# EAGLE design gps_and_sensor_20180111 (EAGLE 8.5.2)
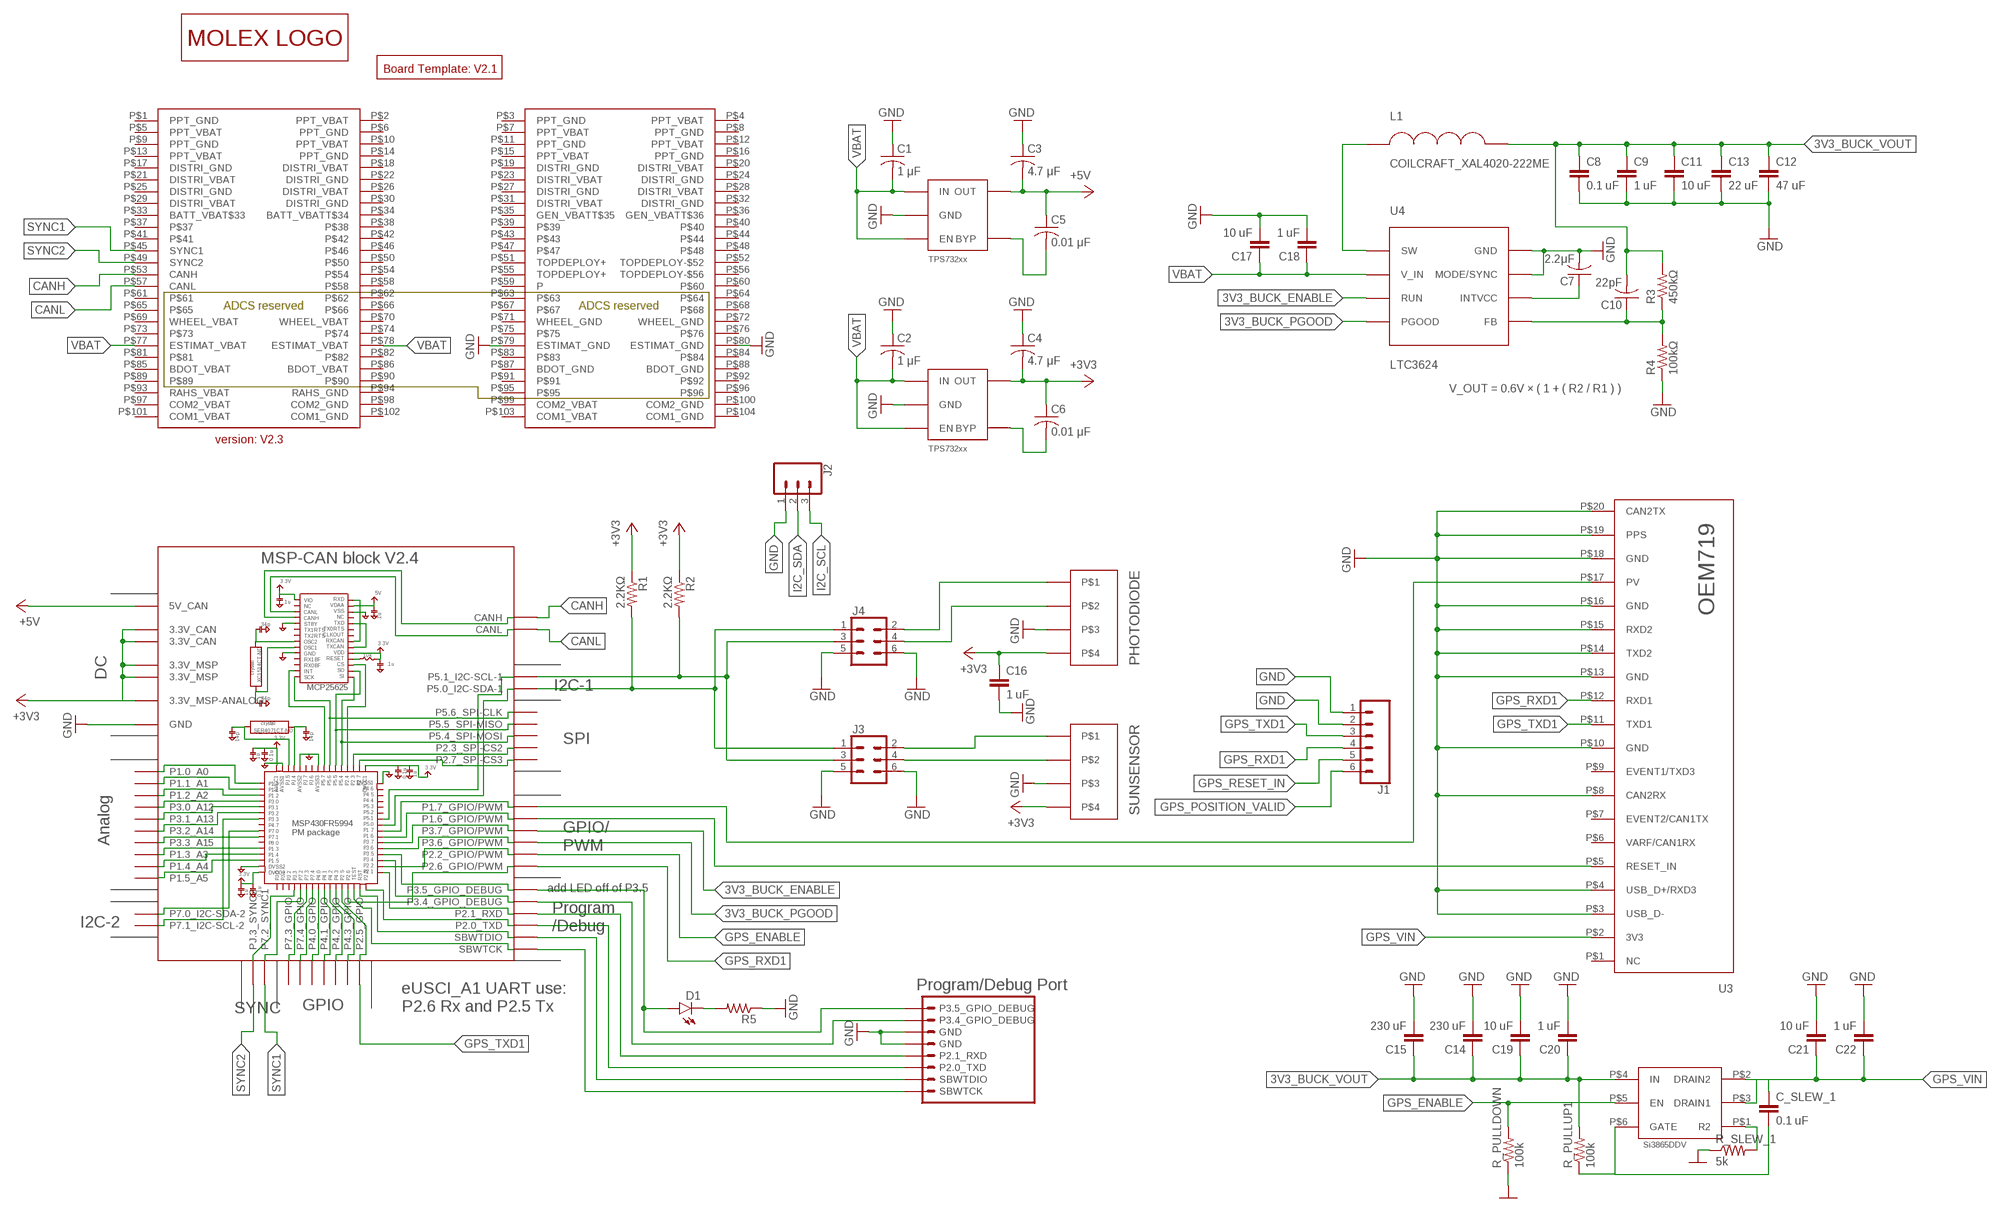
[diagram p0: schematic, sheet 1]

## Parts
B1  BOARD_TEMPLATE1  [BOARD_TEMPLATE]
BLK1  MSP-CAN_BLOCK  [MSP-CAN_BLOCK]
C1  1 μF  C-USC0805  [C0805]
C2  1 μF  C-USC0805  [C0805]
C3  4.7 μF  C-USC0805  [C0805]
C4  4.7 μF  C-USC0805  [C0805]
C5  0.01 μF  C-USC0805  [C0805]
C6  0.01 μF  C-USC0805  [C0805]
C7  2.2μF  C-USC0805  [C0805]
C8  0.1 uF  CAPACITOR0805  [0805]
C9  1 uF  CAPACITOR0805  [0805]
C10  22pF  C-USC0805  [C0805]
C11  10 uF  CAPACITOR0805  [0805]
C12  47 uF  CAPACITOR1206  [1206]
C13  22 uF  CAPACITOR1206  [1206]
C14  230 uF  CAPACITORPANASONIC_16SVPG270M  [PANASONIC_SVPG]
C15  230 uF  CAPACITORPANASONIC_16SVPG270M  [PANASONIC_SVPG]
C16  1 uF  CAPACITOR0805  [0805]
C17  10 uF  CAPACITOR0805  [0805]
C18  1 uF  CAPACITOR0805  [0805]
C19  10 uF  CAPACITOR0805  [0805]
C20  1 uF  CAPACITOR0805  [0805]
C21  10 uF  CAPACITOR0805  [0805]
C22  1 uF  CAPACITOR0805  [0805]
C_SLEW_1  0.1 uF  CAPACITOR0805  [0805]
CONN1  PC104_CONNECTOR  [PC104_CONNECTOR]
D1  LED  [LED-1206]
J1  CONN_06LOCK  [1X06_LOCK]
J2  CONN_03LOCK  [1X03_LOCK]
J3  CONN_03X22X3_SILK_MALE_PTH  [2X3]
J4  CONN_03X22X3_SILK_MALE_PTH  [2X3]
L1  COILCRAFT_XAL4020-222ME  [COILCRAFT_XAL4020]
PHOTODIODE  PICOLOCK_4  [PICOLOCK_4]
R1  2.2KΩ  R-US_R0805  [R0805]
R2  2.2KΩ  R-US_R0805  [R0805]
R3  450kΩ  R-US_R0805  [R0805]
R4  100kΩ  R-US_R0805  [R0805]
R5  RESISTOR0805  [0805]
R_PULLDOWN  100k  RESISTOR0805  [0805]
R_PULLUP1  100k  RESISTOR0805  [0805]
R_SLEW_1  5k  RESISTOR0805  [0805]
SUNSENSOR  PICOLOCK_4  [PICOLOCK_4]
U1  TPS732XX  [SOT-23-5]
U2  TPS732XX  [SOT-23-5]
U3  OEM719  [OEM719]
U4  LTC3624  [LTC3624]
U$1  LOGO_MOLEX  [LOGO_MOLEX]
U$2  PROGRAM/DEBUG_PORT  [1X08_CONNECTOR]
U$3  SI3865DDV  [TSOP-6]

## Nets
3V3_BUCK_ENABLE: BLK1.P3.7_GPIO/PWM U4.RUN
3V3_BUCK_FB: C10.1 R3.1 R4.2 U4.FB
3V3_BUCK_INTVCC: C7.1 U4.INTVCC
3V3_BUCK_PGOOD: BLK1.P3.6_GPIO/PWM U4.PGOOD
3V3_BUCK_SW: L1.P$1 U4.SW
3V3_BUCK_VOUT: C8.1 C9.1 C10.2 C11.1 C12.1 C13.1 C14.POS C15.POS C19.1 C20.1 L1.P$2 R3.2 R_PULLUP1.2 U$3.P$4(IN)
CANH: BLK1.CANH CONN1.P$53(CANH)
CANL: BLK1.CANL CONN1.P$57(CANL)
GND: BLK1.GND@1(GND) BLK1.GND@2(GND) BLK1.GND@3(GND) BLK1.GND@4(GND) BLK1.GND@5(GND) BLK1.GND@7(GND) BLK1.GND@8(GND) BLK1.GND@9(GND) BLK1.GND@10(GND) BLK1.GND@11(GND) BLK1.GND@12(GND) BLK1.GND@13(GND) BLK1.GND@14(GND) BLK1.GND@15(GND) BLK1.GND@16(GND) BLK1.GND@17(GND) BLK1.GND@26(GND) C1.1 C2.1 C3.1 C4.1 C7.2 C8.2 C9.2 C11.2 C12.2 C13.2 C14.NEG C15.NEG C16.2 C17.2 C18.2 C19.2 C20.2 C21.2 C22.2 CONN1.P$79(ESTIMAT_GND) CONN1.P$80(ESTIMAT_GND) J1.1 J1.2 J2.1 J3.5 J3.6 J4.5 J4.6 PHOTODIODE.P$3 R4.1 R5.1 R_PULLDOWN.1 R_SLEW_1.1 SUNSENSOR.P$3 U1.P$2(GND) U2.P$2(GND) U3.P$3(USB_D-) U3.P$4(USB_D+/RXD3) U3.P$8(CAN2RX) U3.P$10(GND) U3.P$13(GND) U3.P$14(TXD2) U3.P$15(RXD2) U3.P$16(GND) U3.P$18(GND) U3.P$19(PPS) U3.P$20(CAN2TX) U4.GND@1(GND) U4.GND@PAD(GND) U4.MODE/SYNC U$2.5(GND) U$2.6(GND) ; supply symbol labelled DGND
GPS_ENABLE: BLK1.P2.2_GPIO/PWM R_PULLDOWN.2 U$3.P$5(EN)
GPS_POSITION_VALID: BLK1.P1.7_GPIO/PWM J1.6 U3.P$17(PV)
GPS_RESET_IN: BLK1.P1.6_GPIO/PWM J1.5 U3.P$5(RESET_IN)
GPS_RXD1: BLK1.P2.6_GPIO/PWM J1.4 U3.P$12(RXD1)
GPS_TXD1: BLK1.P2.5_GPIO J1.3 U3.P$11(TXD1)
GPS_VIN: C21.1 C22.1 C_SLEW_1.1 U3.P$2(3V3) U$3.P$2(DRAIN2) U$3.P$3(DRAIN1)
I2C_SCL: BLK1.P5.1_I2C-SCL-1 J2.3 J3.3 J4.3 R2.2
I2C_SDA: BLK1.P5.0_I2C-SDA-1 J2.2 J3.1 J4.1 R1.2
LDO_3V3: BLK1.3.3V@CAN1(3.3V_CAN) BLK1.3.3V@CAN2(3.3V_CAN) BLK1.3.3V@MSP1(3.3V_MSP) BLK1.3.3V@MSP2(3.3V_MSP) BLK1.3.3V_ANALOG@MSP2(3.3V_MSP-ANALOG) C4.2 C6.1 C16.1 PHOTODIODE.P$4 R1.1 R2.1 SUNSENSOR.P$4 U2.P$5(OUT) ; supply symbol labelled +3V3
LDO_3V3_BYP: C6.2 U2.P$4(BYP)
LDO_5V: BLK1.5V(5V_CAN) C3.2 C5.1 U1.P$5(OUT) ; supply symbol labelled +5V
LDO_5V_BYP: C5.2 U1.P$4(BYP)
N$1: BLK1.P3.5_GPIO_DEBUG D1.A U$2.8(P3.5_GPIO_DEBUG)
N$2: R_SLEW_1.2 U$3.P$1(R2)
N$3: BLK1.P3.4_GPIO_DEBUG U$2.7(P3.4_GPIO_DEBUG)
N$4: C_SLEW_1.2 R_PULLUP1.1 U$3.P$6(GATE)
N$5: BLK1.P2.1_RXD U$2.4(P2.1_RXD)
N$6: BLK1.P2.0_TXD U$2.3(P2.0_TXD)
N$7: BLK1.SBWTDIO U$2.2(SBWTDIO)
N$8: BLK1.SBWTCK U$2.SBWTCK
N$9: D1.C R5.2
PHOTODIODE_SCL: J4.4 PHOTODIODE.P$2
PHOTODIODE_SDA: J4.2 PHOTODIODE.P$1
SUNSENSOR_SCL: J3.4 SUNSENSOR.P$2
SUNSENSOR_SDA: J3.2 SUNSENSOR.P$1
SYNC1: BLK1.P7.2_SYNC1 CONN1.P$45(SYNC1)
SYNC2: BLK1.PJ.3_SYNC2 CONN1.P$49(SYNC2)
VBAT: C1.2 C2.2 C17.1 C18.1 CONN1.P$77(ESTIMAT_VBAT) CONN1.P$78(ESTIMAT_VBAT) U1.P$1(IN) U1.P$3(EN) U2.P$1(IN) U2.P$3(EN) U4.V_IN
Unconnected: BLK1.P1.0_A0 BLK1.P1.1_A1 BLK1.P1.2_A2 BLK1.P1.3_A3 BLK1.P1.4_A4 BLK1.P1.5_A5 BLK1.P2.4_SPI-CS2(P2.3_SPI-CS2) BLK1.P2.7_SPI-CS3 BLK1.P3.0_A12 BLK1.P3.1_A13 BLK1.P3.2_A14 BLK1.P3.3_A15 BLK1.P4.0_GPIO BLK1.P4.1_GPIO BLK1.P4.2_GPIO BLK1.P4.3_GPIO BLK1.P5.4_SPI-MOSI BLK1.P5.5_SPI-MISO BLK1.P5.6_SPI-CLK BLK1.P7.0_I2C-SDA-2 BLK1.P7.1_I2C-SCL-2 BLK1.P7.3_GPIO BLK1.P7.4_GPIO CONN1.P$1(PPT_GND) CONN1.P$2(PPT_VBAT) CONN1.P$3(PPT_GND) CONN1.P$4(PPT_VBAT) CONN1.P$5(PPT_VBAT) CONN1.P$6(PPT_GND) CONN1.P$7(PPT_VBAT) CONN1.P$8(PPT_GND) CONN1.P$9(PPT_GND) CONN1.P$10(PPT_VBAT) CONN1.P$11(PPT_GND) CONN1.P$12(PPT_VBAT) CONN1.P$13(PPT_VBAT) CONN1.P$14(PPT_GND) CONN1.P$15(PPT_VBAT) CONN1.P$16(PPT_GND) CONN1.P$17(DISTRI_GND) CONN1.P$18(DISTRI_VBAT) CONN1.P$19(DISTRI_GND) CONN1.P$20(DISTRI_VBAT) CONN1.P$21(DISTRI_VBAT) CONN1.P$22(DISTRI_GND) CONN1.P$23(DISTRI_VBAT) CONN1.P$24(DISTRI_GND) CONN1.P$25(DISTRI_GND) CONN1.P$26(DISTRI_VBAT) CONN1.P$27(DISTRI_GND) CONN1.P$28(DISTRI_VBAT) CONN1.P$29(DISTRI_VBAT) CONN1.P$30(DISTRI_GND) CONN1.P$31(DISTRI_VBAT) CONN1.P$32(DISTRI_GND) CONN1.P$33(BATT_VBAT$33) CONN1.P$34(BATT_VBATT$34) CONN1.P$35(GEN_VBATT$35) CONN1.P$36(GEN_VBATT$36) CONN1.P$37 CONN1.P$38 CONN1.P$39 CONN1.P$40 CONN1.P$41 CONN1.P$42 CONN1.P$43 CONN1.P$44 CONN1.P$46 CONN1.P$47 CONN1.P$48 CONN1.P$50 CONN1.P$51(TOPDEPLOY+) CONN1.P$52(TOPDEPLOY-$52) CONN1.P$54 CONN1.P$55(TOPDEPLOY+) CONN1.P$56(TOPDEPLOY-$56) CONN1.P$58 CONN1.P$59(P) CONN1.P$60 CONN1.P$61 CONN1.P$62 CONN1.P$63 CONN1.P$64 CONN1.P$65 CONN1.P$66 CONN1.P$67 CONN1.P$68 CONN1.P$69(WHEEL_VBAT) CONN1.P$70(WHEEL_VBAT) CONN1.P$71(WHEEL_GND) CONN1.P$72(WHEEL_GND) CONN1.P$73 CONN1.P$74 CONN1.P$75 CONN1.P$76 CONN1.P$81 CONN1.P$82 CONN1.P$83 CONN1.P$84 CONN1.P$85(BDOT_VBAT) CONN1.P$86(BDOT_VBAT) CONN1.P$87(BDOT_GND) CONN1.P$88(BDOT_GND) CONN1.P$89 CONN1.P$90 CONN1.P$91 CONN1.P$92 CONN1.P$93(RAHS_VBAT) CONN1.P$94(RAHS_GND) CONN1.P$95 CONN1.P$96 CONN1.P$97(COM2_VBAT) CONN1.P$98(COM2_GND) CONN1.P$99(COM2_VBAT) CONN1.P$100(COM2_GND) CONN1.P$101(COM1_VBAT) CONN1.P$102(COM1_GND) CONN1.P$103(COM1_VBAT) CONN1.P$104(COM1_GND) U3.P$1(NC) U3.P$6(VARF/CAN1RX) U3.P$7(EVENT2/CAN1TX) U3.P$9(EVENT1/TXD3)

## Notes on the sheet
- V_OUT = 0.6V × ( 1 + ( R2 / R1 ) )

## Library data of the parts
B1 = DubSat1 Components:BOARD_TEMPLATE
BLK1 = DubSat1 Components:MSP-CAN_BLOCK
C1-C7 C10 = rcl:C-US: CAPACITOR, American symbol
C8 C9 C11-C22 C_SLEW_1 = DubSat1 Components:CAPACITOR: Capacitor Standard 0603 ceramic capacitor, and 0.1" leaded capacitor.
CONN1 = DubSat1 Components:PC104_CONNECTOR
D1 = DubSat1 Components:LED
J1 = SparkFun-Connectors:CONN_06: Multi connection point. Often used as Generic Header-pin footprint for 0.1 inch spaced/style header connections On any of the 0.1 inch spaced packages, you can populate with these: Break Away Headers - Straight <https://www.sparkfun.com/products/116> (PRT-00116) Break Away Male Headers - Right Angle <https://www.sparkfun.com/products/553> (PRT-00553) Female Headers <https://www.sparkfun.com/products/115> (PRT-00115) Break Away Headers - Machine Pin <https://www.sparkfun.com/products/117> (PRT-00117) Break Away Female Headers - Swiss Machine Pin <https://www.sparkfun.com/products/743> (PRT-00743) Arduino Stackable Header - 6 Pin <https://www.sparkfun.com/products/9280> (PRT-09280) For SCREWTERMINALS and SPRING TERMINALS visit here: Screw Terimnals on SparkFun.com <https://www.sparkfun.com/search/results?term=Screw+Terminals> (5mm/3.5mm/2.54mm spacing) This device is also useful as a general connection point to wire up your design to another part of your project. Our various solder wires solder well into these plated through hole pads. Hook-Up Wire - Assortment (Stranded, 22 AWG) <https://www.sparkfun.com/products/11375> (PRT-11375) Hook-Up Wire - Assortment (Solid Core, 22 AWG) <https://www.sparkfun.com/products/11367> (PRT-11367) View the entire wire category on our website here <https://www.sparkfun.com/categories/141>
J2 = SparkFun-Connectors:CONN_03: Multi connection point. Often used as Generic Header-pin footprint for 0.1 inch spaced/style header connections On any of the 0.1 inch spaced packages, you can populate with these: Break Away Headers - Straight <https://www.sparkfun.com/products/116> (PRT-00116) Break Away Male Headers - Right Angle <https://www.sparkfun.com/products/553> (PRT-00553) Female Headers <https://www.sparkfun.com/products/115> (PRT-00115) Break Away Headers - Machine Pin <https://www.sparkfun.com/products/117> (PRT-00117) Break Away Female Headers - Swiss Machine Pin <https://www.sparkfun.com/products/743> (PRT-00743) Stackable Header - 3 Pin (Female, 0.1") <https://www.sparkfun.com/products/13875> (PRT-13875) For SCREWTERMINALS and SPRING TERMINALS visit here: Screw Terimnals on SparkFun.com <https://www.sparkfun.com/search/results?term=Screw+Terminals> (5mm/3.5mm/2.54mm spacing) This device is also useful as a general connection point to wire up your design to another part of your project. Our various solder wires solder well into these plated through hole pads. Hook-Up Wire - Assortment (Stranded, 22 AWG) <https://www.sparkfun.com/products/11375> (PRT-11375) Hook-Up Wire - Assortment (Solid Core, 22 AWG) <https://www.sparkfun.com/products/11367> (PRT-11367) View the entire wire category on our website here <https://www.sparkfun.com/categories/141> Special notes: Molex polarized connector foot print use with SKU : PRT-08232 with associated crimp pins and housings.
J3 J4 = SparkFun-Connectors:CONN_03X2: Multi connection point. Often used as Generic Header-pin footprint for 0.1 inch spaced/style header connections You can populate with any combo of single row headers, but if you'd like an exact match, check these: Header - 2x3 (Male, 0.1") <https://www.sparkfun.com/products/12807> (PRT-12807) Header - 2x3 (Female, 0.1") <https://www.sparkfun.com/products/13010> (PRT-13010) 2x3 Pin Shrouded Header <https://www.sparkfun.com/products/10877> (PRT-10877) On any of the 0.1 inch spaced packages, you can populate with these: Break Away Headers - Straight <https://www.sparkfun.com/products/116> (PRT-00116) Break Away Male Headers - Right Angle <https://www.sparkfun.com/products/553> (PRT-00553) Female Headers <https://www.sparkfun.com/products/115> (PRT-00115) Break Away Headers - Machine Pin <https://www.sparkfun.com/products/117> (PRT-00117) Break Away Female Headers - Swiss Machine Pin <https://www.sparkfun.com/products/743> (PRT-00743) Special note: the shrouded connector mates well with our 3x2 ribbon cables: Ribbon Crimp Connector - 6-pin (2x3, Female) <https://www.sparkfun.com/products/10651> (PRT-10651) Ribbon Cable - 6 wire (15ft) <https://www.sparkfun.com/products/10646> (PRT-10646); PROD_ID: CONN-09701
L1 = DubSat1 Components:COILCRAFT_XAL4020-222ME
PHOTODIODE SUNSENSOR = DubSat1 Components:PICOLOCK_4
R1-R4 = rcl:R-US_: RESISTOR, American symbol
R5 R_PULLDOWN R_PULLUP1 R_SLEW_1 = DubSat1 Components:RESISTOR: Resistor Basic schematic elements and footprints for 0603, 1206, and PTH resistors.
U1 U2 = DubSat1 Components:TPS732XX
U3 = DubSat1 Components:OEM719
U4 = DubSat1 Components:LTC3624
U$1 = HuskySat-1 Logos:LOGO_MOLEX
U$2 = DubSat1 Components:PROGRAM/DEBUG_PORT
U$3 = DubSat1 Components:SI3865DDV

## Board
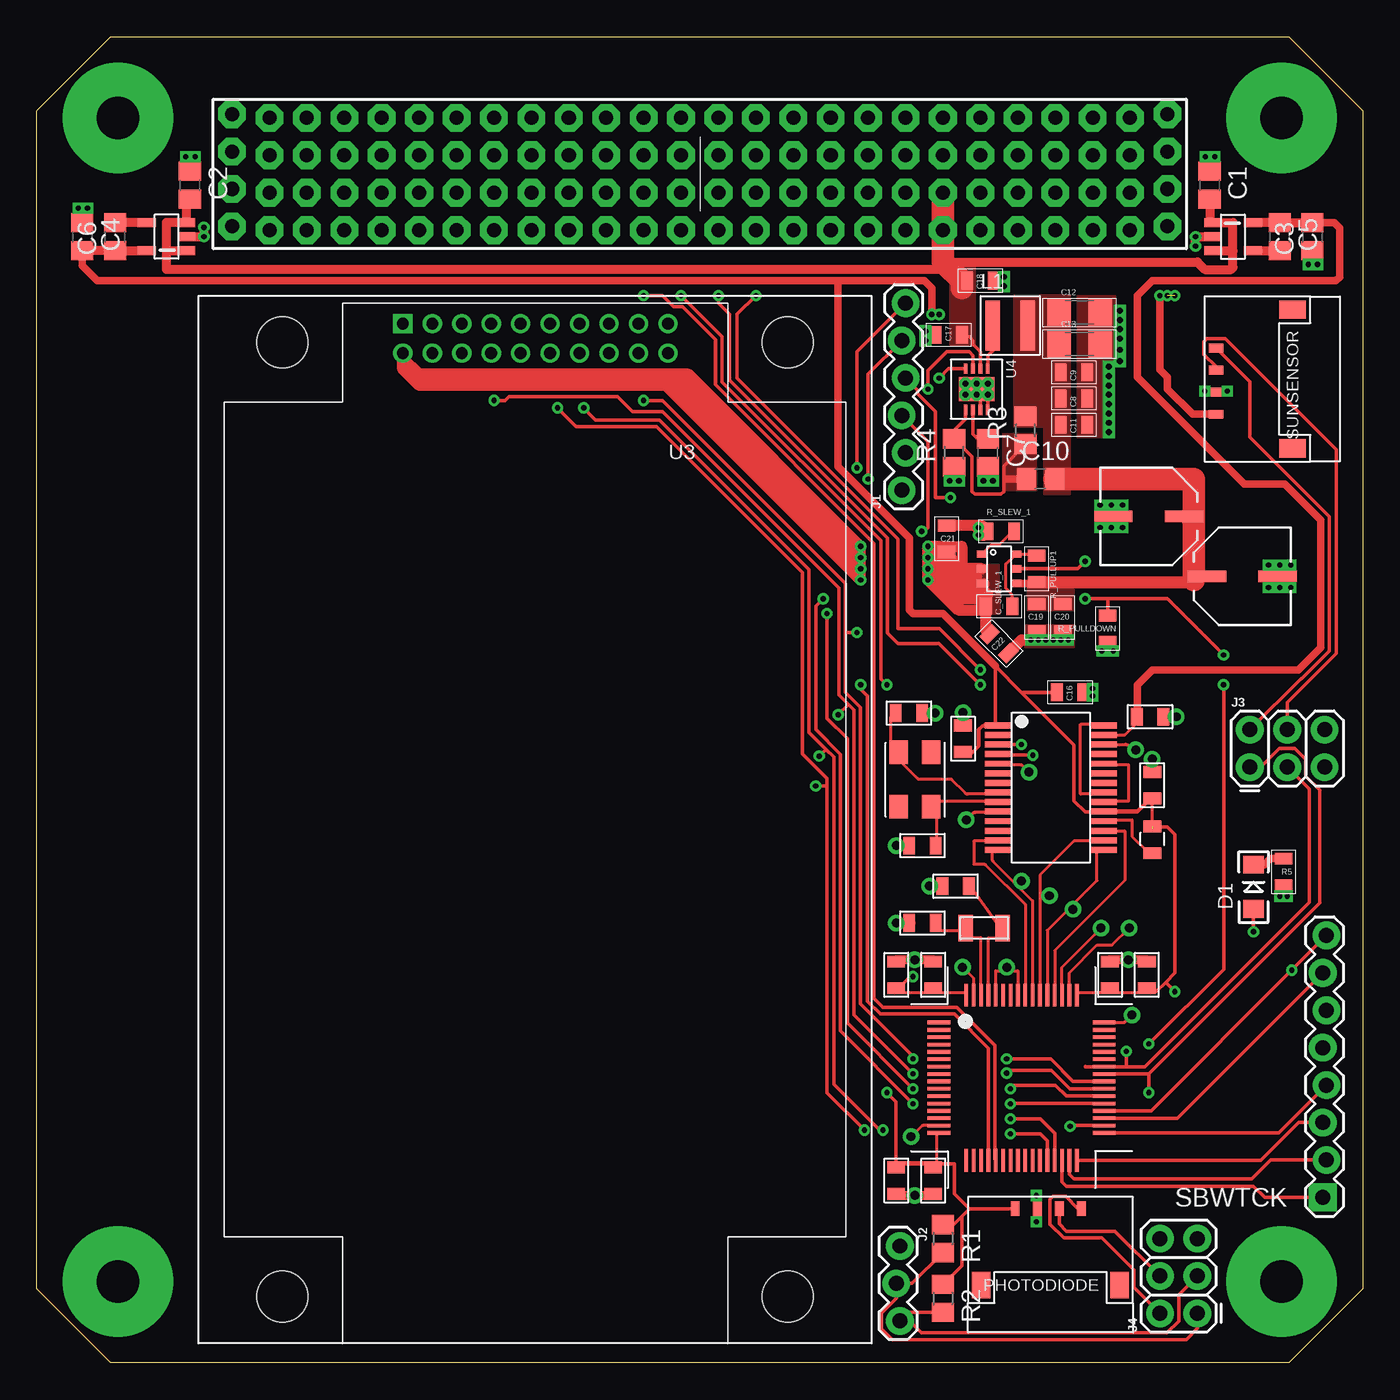
[diagram p1: board, top side]
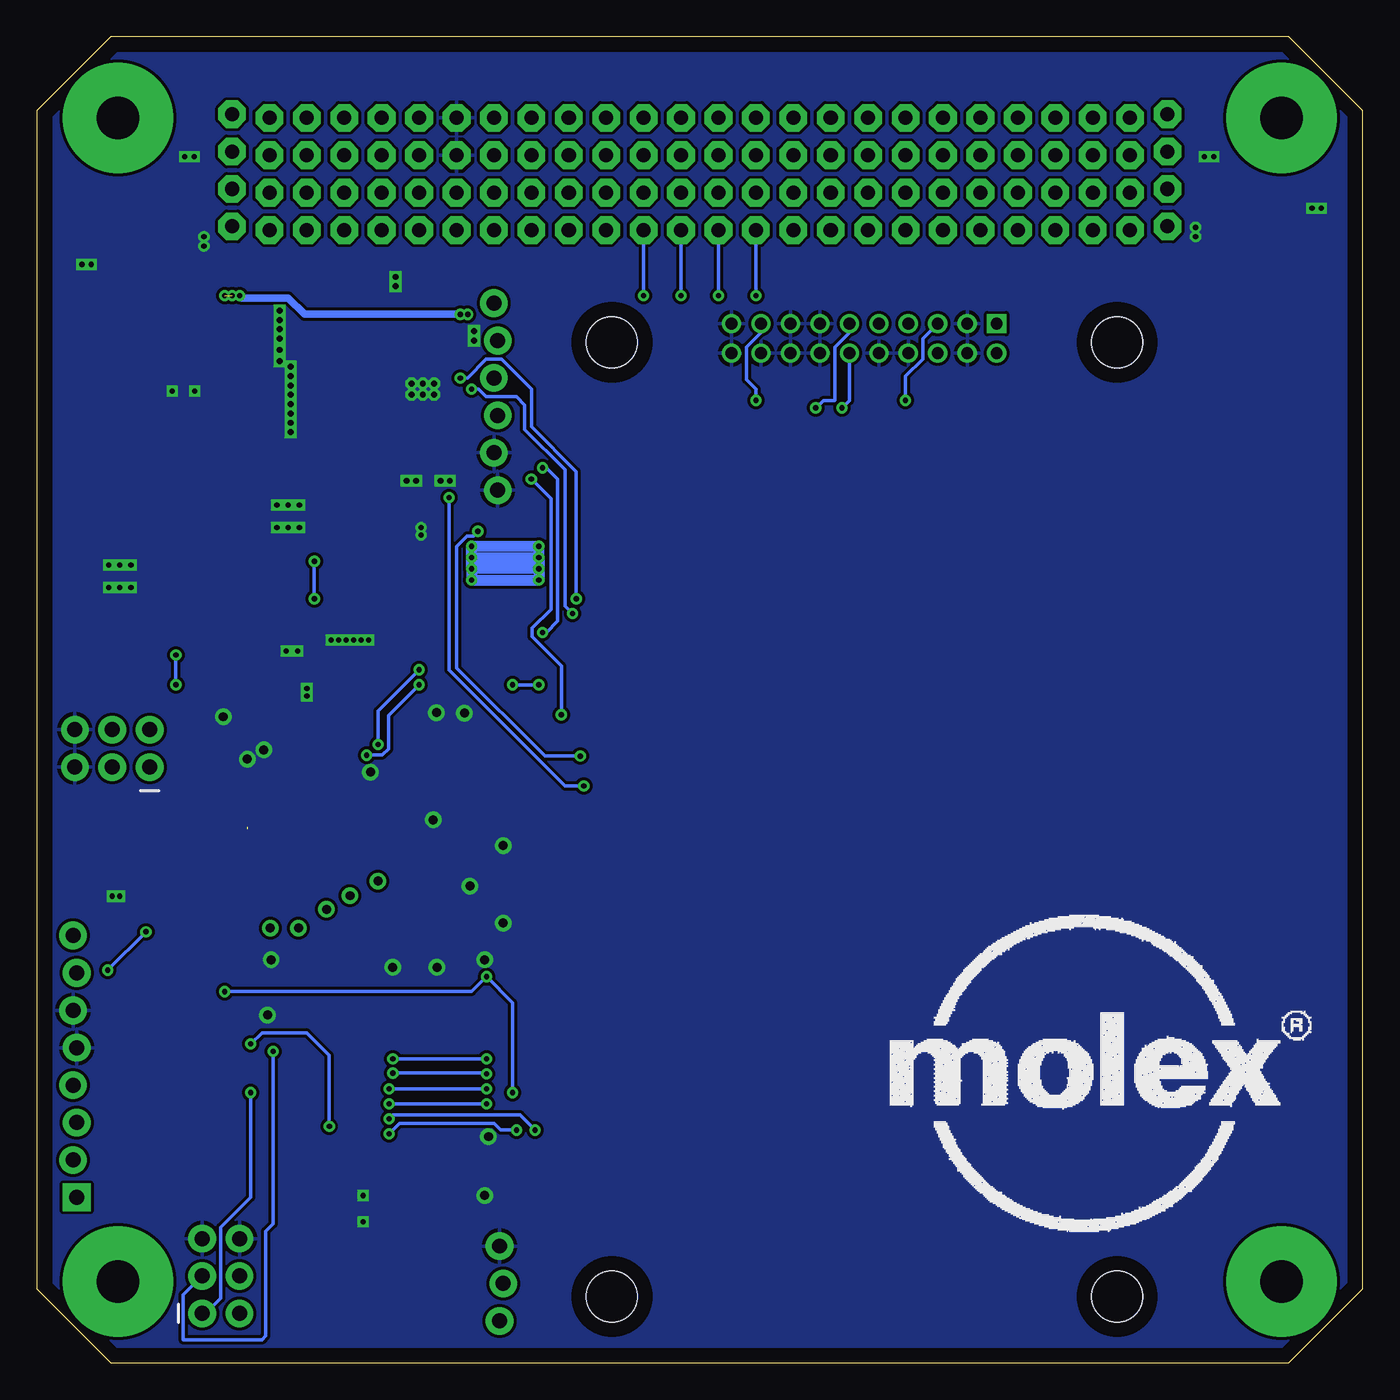
[diagram p2: board, bottom side, seen from below]

Size 90 x 90 mm. Coordinates in mm from the lower left corner, seen from the top.
Copper layers (1*16): Top 0.035mm / dielectric 1.5mm / Bottom 0.035mm
Design rules "default *": minimum track width 8mil, minimum drill 0.4mm, track to track 8mil, track to pad 8mil, pad to pad 8mil, via to via 8mil, smd to smd 0mil, copper to edge 40mil, drill to drill 6mil, minimum pad ring 10mil, minimum via ring 8mil, stop-mask expansion 4mil, vias tented up to drill 0mil, thermal gap 10mil

### Footprints (pad centres in the part's own frame; a part is rotated, then mirrored left to right if it is on the bottom)
BOARD_TEMPLATE = drill 2.9 pad 7.5: P$1 -39.5,39.5; P$2 -39.5,-39.5; P$3 39.5,-39.5; P$4 39.5,39.5
MSP-CAN_BLOCK = smd 1.2 x 0.8: 1 -6,6.08; 2 -6,7.88; 3 -8.5,6.08; 4 -8.5,7.88; 9 -8.5,-6.08; 10 -8.5,-7.88; 11 -6,-6.08; 12 -6,-7.88; 13 8.5,6.08; 14 8.5,7.88; 15 6,6.08; 16 6,7.88; 23 8.875,18.955; 24 8.875,20.755; 25 8.875,17.045; 26 8.875,15.245; 27 -3.975,22.105; 28 -3.975,23.905 | smd 1 x 0.25: 3.3V@CAN1 -3.975,22.025; 3.3V@CAN2 8.875,18.875; 3.3V@MSP1 8.501,5.884; 3.3V@MSP2 -8.533,-5.962; 3.3V_ANALOG@MSP2 -8.482,5.904 | smd 0.8 x 1.2: 5 -5.83,10.5; 6 -7.63,10.5; 7 -3.58,13; 8 -5.38,13; 17 -8.545,24.75; 18 -6.745,24.75; 19 -5.83,15.75; 20 -7.63,15.75; 21 7.83,24.5; 22 9.63,24.5 | smd 0.25 x 1: 5V 7.65,24.5 | smd 1.75 x 0.4: CANH -1.6,21.96; CANL -1.6,22.61; P$65 -1.6,23.91; P$66 -1.6,23.26; P$69 -1.6,21.31; P$70 -1.6,20.66; P$71 -1.6,20.01; P$72 -1.6,19.36; P$73 -1.6,18.71; P$74 -1.6,18.06; P$75 -1.6,17.41; P$76 -1.6,16.76; P$77 -1.6,16.11; P$78 -1.6,15.46; P$79 5.6,15.46; P$80 5.6,16.11; P$81 5.6,16.76; P$82 5.6,17.41; P$83 5.6,18.06; P$84 5.6,18.71; P$85 5.6,19.36; P$86 5.6,20.01; P$87 5.6,20.66; P$88 5.6,21.31; P$89 5.6,21.96; P$90 5.6,22.61; P$91 5.6,23.26; P$92 5.6,23.91 | drill 0.61: GND@1 -3.975,24.775; GND@2 -5.875,24.75; GND@3 -3.75,17.5; GND@4 0.5,20.75; GND@5 -8.5,15.75; GND@7 -8.5,10.5; GND@8 -7.25,8; GND@9 -4,7.5; GND@10 -1,7.5; GND@11 7.75,22.25; GND@12 10.5,24.5; GND@13 8.875,21.625; GND@14 7.25,8; GND@15 7.5,4.25; GND@16 -7.5,-4; GND@17 -7.25,-8; GND@26 -6.25,13; P2.4_SPI-CS2 5.397,10.16; P2.7_SPI-CS3 7.303,10.16; P5.4_SPI-MOSI 3.487,11.434; P5.5_SPI-MISO 1.9,12.354; P5.6_SPI-CLK 0,13.348 | smd 1.55 x 0.25: P1.0_A0 -5.6,3.75; P1.1_A1 -5.6,3.25; P1.2_A2 -5.6,2.75; P1.3_A3 -5.6,-1.75; P1.4_A4 -5.6,-2.25; P1.5_A5 -5.6,-2.75; P1.6_GPIO/PWM 5.6,-0.75; P1.7_GPIO/PWM 5.6,-0.25; P2.1_RXD 5.6,-3.75; P2.2_GPIO/PWM 5.6,-3.25; P3.0_A12 -5.6,2.25; P3.1_A13 -5.6,1.75; P3.2_A14 -5.6,1.25; P3.3_A15 -5.6,0.75; P3.4_GPIO_DEBUG 5.6,-2.75; P3.5_GPIO_DEBUG 5.6,-2.25; P3.6_GPIO/PWM 5.6,-1.75; P3.7_GPIO/PWM 5.6,-1.25; P5.0_I2C-SDA-1 5.6,0.25; P5.1_I2C-SCL-1 5.6,0.75; P7.0_I2C-SDA-2 -5.6,-0.25; P7.1_I2C-SCL-2 -5.6,-0.75; P$8 -5.6,0.25; P$11 -5.6,-1.25; P$15 -5.6,-3.25; P$16 -5.6,-3.75; P$43 5.6,1.25; P$44 5.6,1.75; P$45 5.6,2.25; P$46 5.6,2.75; P$47 5.6,3.25; P$48 5.6,3.75 | smd 0.25 x 1.55: P2.0_TXD 3.75,-5.6; P2.5_GPIO 1.75,-5.6; P2.6_GPIO/PWM 2.25,-5.6; P4.0_GPIO -0.25,-5.6; P4.1_GPIO 0.25,-5.6; P4.2_GPIO 0.75,-5.6; P4.3_GPIO 1.25,-5.6; P7.2_SYNC1 -1.75,-5.6; P7.3_GPIO -1.25,-5.6; P7.4_GPIO -0.75,-5.6; P$17 -3.75,-5.6; P$18 -3.25,-5.6; P$19 -2.75,-5.6; P$49 3.75,5.6; P$50 3.25,5.6; P$51 2.75,5.6; P$52 2.25,5.6; P$53 1.75,5.6; P$54 1.25,5.6; P$55 0.75,5.6; P$56 0.25,5.6; P$57 -0.25,5.6; P$58 -0.75,5.6; P$59 -1.25,5.6; P$60 -1.75,5.6; P$61 -2.25,5.6; P$62 -2.75,5.6; P$63 -3.25,5.6; P$64 -3.75,5.6; PJ.3_SYNC2 -2.25,-5.6; SBWTCK 2.75,-5.6; SBWTDIO 3.25,-5.6 | smd 1 x 1.8: P$93 -3.79,10.16; P$94 -1.29,10.16 | smd 1.25 x 1.6: P$104 -6.13,18.38; P$105 -6.13,22.08; P$106 -8.33,22.08; P$107 -8.33,18.38
C0805 = smd 1.3 x 1.5: 1 -0.95,0; 2 0.95,0
0805 = smd 0.8 x 1.2: 1 -0.9,0; 2 0.9,0
1206 = smd 1.6 x 1.8: 1 -1.4,0; 2 1.4,0
PANASONIC_SVPG = smd 0.8 x 2.6: NEG 0,2.4; POS 0,-2.4
PC104_CONNECTOR = drill 0.953 pad 1.88 octagon: P$1 -31.75,32.134; P$2 -31.75,34.674; P$3 -31.75,37.214; P$4 -31.75,39.754; P$5 -29.21,31.88; P$6 -29.21,34.42; P$7 -29.21,36.96; P$8 -29.21,39.5; P$9 -26.67,31.88; P$10 -26.67,34.42; P$11 -26.67,36.96; P$12 -26.67,39.5; P$13 -24.13,31.88; P$14 -24.13,34.42; P$15 -24.13,36.96; P$16 -24.13,39.5; P$17 -21.59,31.88; P$18 -21.59,34.42; P$19 -21.59,36.96; P$20 -21.59,39.5; P$21 -19.05,31.88; P$22 -19.05,34.42; P$23 -19.05,36.96; P$24 -19.05,39.5; P$25 -16.51,31.88; P$26 -16.51,34.42; P$27 -16.51,36.96; P$28 -16.51,39.5; P$29 -13.97,31.88; P$30 -13.97,34.42; P$31 -13.97,36.96; P$32 -13.97,39.5; P$33 -11.43,31.88; P$34 -11.43,34.42; P$35 -11.43,36.96; P$36 -11.43,39.5; P$37 -8.89,31.88; P$38 -8.89,34.42; P$39 -8.89,36.96; P$40 -8.89,39.5; P$41 -6.35,31.88; P$42 -6.35,34.42; P$43 -6.35,36.96; P$44 -6.35,39.5; P$45 -3.81,31.88; P$46 -3.81,34.42; P$47 -3.81,36.96; P$48 -3.81,39.5; P$49 -1.27,31.88; P$50 -1.27,34.42; P$51 -1.27,36.96; P$52 -1.27,39.5; P$53 1.27,31.88; P$54 1.27,34.42; P$55 1.27,36.96; P$56 1.27,39.5; P$57 3.81,31.88; P$58 3.81,34.42; P$59 3.81,36.96; P$60 3.81,39.5; P$61 6.35,31.88; P$62 6.35,34.42; P$63 6.35,36.96; P$64 6.35,39.5; P$65 8.89,31.88; P$66 8.89,34.42; P$67 8.89,36.96; P$68 8.89,39.5; P$69 11.43,31.88; P$70 11.43,34.42; P$71 11.43,36.96; P$72 11.43,39.5; P$73 13.97,31.88; P$74 13.97,34.42; P$75 13.97,36.96; P$76 13.97,39.5; P$77 16.51,31.88; P$78 16.51,34.42; P$79 16.51,36.96; P$80 16.51,39.5; P$81 19.05,31.88; P$82 19.05,34.42; P$83 19.05,36.96; P$84 19.05,39.5; P$85 21.59,31.88; P$86 21.59,34.42; P$87 21.59,36.96; P$88 21.59,39.5; P$89 24.13,31.88; P$90 24.13,34.42; P$91 24.13,36.96; P$92 24.13,39.5; P$93 26.67,31.88; P$94 26.67,34.42; P$95 26.67,36.96; P$96 26.67,39.5; P$97 29.21,31.88; P$98 29.21,34.42; P$99 29.21,36.96; P$100 29.21,39.5; P$101 31.75,32.134; P$102 31.75,34.674; P$103 31.75,37.214; P$104 31.75,39.754
LED-1206 = smd 1.2 x 1.4: A -1.5,0; C 1.5,0
1X06_LOCK = drill 1.016 pad 1.88: 1 0,0; 2 2.54,-0.254; 3 5.08,0; 4 7.62,-0.254; 5 10.16,0; 6 12.7,-0.254
1X03_LOCK = drill 1.016 pad 1.88: 1 0,0.127; 2 2.54,-0.127; 3 5.08,0.127
2X3 = drill 1.016 pad 1.88: 1 0,0; 2 0,2.54; 3 2.54,0; 4 2.54,2.54; 5 5.08,0; 6 5.08,2.54
COILCRAFT_XAL4020 = smd 0.98 x 3.4: P$1 -1.185,0; P$2 1.185,0
PICOLOCK_4 = smd 1.25 x 1.8: MNT@1 -2.605,5.2; MNT@2 6.805,5.2 | smd 0.6 x 1: P$1 0,0; P$2 1.5,0; P$3 3,0; P$4 4.5,0
R0805 = smd 1.3 x 1.5: 1 -0.95,0; 2 0.95,0
SOT-23-5 = smd 0.6 x 1.2: P$1 -0.95,-1.35; P$2 0,-1.35; P$3 0.95,-1.35; P$4 0.95,1.35; P$5 -0.95,1.35
OEM719 = drill 0.8 square: P$1 69.22,31.84 | drill 0.8: P$2 67.22,31.84; P$3 69.22,29.84; P$4 67.22,29.84; P$5 69.22,27.84; P$6 67.22,27.84; P$7 69.22,25.84; P$8 67.22,25.84; P$9 69.22,23.84; P$10 67.22,23.84; P$11 69.22,21.84; P$12 67.22,21.84; P$13 69.22,19.84; P$14 67.22,19.84; P$15 69.22,17.84; P$16 67.22,17.84; P$17 69.22,15.84; P$18 67.22,15.84; P$19 69.22,13.84; P$20 67.22,13.84 | hole 3.45: 3.18,5.72; 3.18,40.01; 67.95,5.72; 67.95,40.01
LTC3624 = smd 0.7 x 0.25: FB 1.4,-0.75; GND@1 1.4,0.75; INTVCC 1.4,-0.25; MODE/SYNC 1.4,0.25; PGOOD -1.4,-0.75; RUN -1.4,-0.25; SW -1.4,0.75; V_IN -1.4,0.25 | smd 1.65 x 2.38: GND@PAD 0,0
1X08_CONNECTOR = drill 1.016 pad 1.88: 2 2.54,-0.127; 3 5.08,0.127; 4 7.62,-0.127; 5 10.16,0.127; 6 12.7,-0.127; 7 15.24,0.127; 8 17.78,-0.127 | drill 1.016 pad 1.88 square: SBWTCK 0,0.127
TSOP-6 = smd 0.508 x 0.7: P$1 -1,-1.162; P$2 0,-1.162; P$3 1,-1.162; P$4 1,1.162; P$5 0,1.162; P$6 -1,1.162

### Placement (x,y rotation side)
B1  45,45 0 top
BLK1  66.84,19.35 0 top
C1  79.61,79.92 270 top
C2  10.39,79.92 270 top
C3  86.59,76.43 90 top
C4  3.09,76.43 270 top
C5  84.37,76.43 270 top
C6  5.31,76.43 90 top
C7  64.56,61.76 270 top
C8  70.4,65.45 0 top
C9  70.4,67.22 0 top
C10  68.11,59.99 0 top
C11  70.4,63.67 0 top
C12  70.78,71.29 0 top
C13  70.78,69.13 0 top
C14  81.83,53.38 270 top
C15  75.48,57.45 90 top
C16  70.15,45.51 0 top
C17  61.89,69.77 180 top
C18  64.05,73.45 0 top
C19  67.86,50.59 270 top
C20  69.64,50.59 270 top
C21  61.76,55.92 90 top
C22  65.32,48.81 315 top
C_SLEW_1  65.32,51.35 0 top
CONN1  45,45 0 top
D1  82.59,32.3 90 top
J1  58.72,59.22 90 top
J2  58.46,7.92 270 top
J3  82.34,40.43 0 top
J4  78.78,3.34 90 top
L1  66.08,70.4 0 top
PHOTODIODE  70.91,10.46 180 top
R1  61.51,8.42 270 top
R2  61.51,4.36 270 top
R3  67.1,63.29 90 top
R4  62.27,61.76 90 top
R5  84.62,33.32 90 top
R_PULLDOWN  72.69,49.83 90 top
R_PULLUP1  67.86,53.89 270 top
R_SLEW_1  65.45,56.43 0 top
SUNSENSOR  80.05,68.88 270 top
U1  81.2,76.43 270 top
U2  8.81,76.43 90 top
U3  56.68,1.31 90 top
U4  63.8,66.08 270 top
U$1  32.05,8.93 0 bottom
U$2  87.42,11.22 90 top
U$3  65.32,53.89 270 top

### Tracks (layer width: path | path; a pad name or v marks a point on that pad's centre or on a via)
3V3_BUCK_ENABLE  (via drill 0.35)
  Top 0.254: v66.08,18.58 66.34,18.84 69.13,18.84 69.87,18.1 BLK1.P3.7_GPIO/PWM | v59.48,18.58 59.48,18.6 55.01,23.07 55.01,42.36 53.64,43.73 v53.64,50.84 | v60.49,66.08 60.49,67.35 61.76,68.62 63.29,68.62 63.54,68.37 U4.RUN
  Bottom 0.254: v66.08,18.58 v59.48,18.58 | v53.64,50.84 54.14,51.35 54.14,60.61 56.89,63.35 56.89,65.02 57.45,65.57 59.5,65.57 60,66.08 v60.49,66.08
3V3_BUCK_FB
  Top 0.254: R3.1 65.64,60.88 65.64,60.11 | 65.64,60.11 65.64,59.14 65.45,58.95 63.67,58.95 63.48,59.14 63.48,61.51 R4.2 62.27,63.29 63.05,64.06 U4.FB | 65.64,60.11 65.77,59.99
  Top 0.508: 65.77,59.99 C10.1
  pour Top (no thermals): 67.86,59.22 67.86,63.03 65.57,63.03 65.57,59.22
3V3_BUCK_INTVCC
  Top 0.254: U4.INTVCC 63.55,63.03 63.8,62.78 64.49,62.78 C7.1
3V3_BUCK_PGOOD  (via drill 0.35)
  Top 0.254: v66.08,17.57 66.11,17.6 BLK1.P3.6_GPIO/PWM | v59.48,17.57 59.48,17.58 54.55,22.51 54.55,41.29 52.87,42.97 52.87,51.35 v53.38,51.86 | v61.26,66.84 61.89,67.48 U4.PGOOD
  Bottom 0.254: v66.08,17.57 v59.48,17.57 | 61.2,66.79 v61.26,66.84 60.77,66.84 59.5,68.11 58.44,68.11 57.45,67.12 57.45,67.1 56.43,66.08 56.43,63.54 53.38,60.49 v53.38,51.86
3V3_BUCK_SW
  Top 0.254: U4.SW 64.55,68.37 64.56,68.37 64.9,68.71 L1.P$1
3V3_BUCK_VOUT
  Top 0.508: U$3.P$4 67.76,52.89 R_PULLUP1.2
  Top 0.762: C14.POS 78.78,53.38 78.53,53.13 | C15.POS 78.53,56.43
  Top 0.813: 78.53,53.13 78.39,52.99 R_PULLUP1.2
  Top 1.524: C10.2 78.53,59.99 78.53,56.43 78.53,53.13
  pour Top (no thermals): 70.15,72.43 66.34,72.43 66.34,63.54 68.37,63.54 68.37,58.97 70.15,58.97
  pour Top (no thermals): 67.23,51.1 70.4,51.1 70.4,53 67.23,53
CANH  (via drill 0.35)
  Top 0.254: v46.27,72.43 46.27,71.92 47.03,71.16 47.03,66.7 57.75,55.98 57.75,49.53 58.46,48.82 61.24,48.82 v64.05,46.02 | v67.61,41.24 65.31,41.24 BLK1.CANH
  Bottom 0.254: CONN1.P$53 v46.27,72.43 | v64.05,46.02 66.14,43.93 66.14,41.66 66.55,41.24 v67.6,41.24 v67.61,41.24
CANL  (via drill 0.35)
  Top 0.254: v48.81,72.43 47.54,71.16 47.54,66.84 58.46,55.92 58.46,49.83 61.26,49.83 v64.05,47.03 | BLK1.CANL v66.84,41.95
  Bottom 0.254: CONN1.P$57 v48.81,72.43 | v64.05,47.03 66.84,44.24 v66.84,41.95
GND  (via drill 0.35, 0.4)
  Top 0.254: U4.GND@1 64.55,65.33 U4.GND@PAD | U4.MODE/SYNC 64.05,65.83 U4.GND@PAD | U4.GND@PAD v63.8,66.46 | v64.25,59.86 64.56,60.16 C7.2 64.89,60.48 v64.89,59.86 | R4.1 61.97,60.51 v61.97,59.86 v62.6,59.86 | v67.86,11.34 67.91,11.3 PHOTODIODE.P$3 67.91,9.61 v67.86,9.57 | v79.29,65.95 79.97,65.95 SUNSENSOR.P$3 80.73,65.88 v80.81,65.95 | 64.29,56.18 R_SLEW_1.1 | v84.37,31.66 84.37,32.16 R5.1 84.62,31.92 v84.88,31.66 | 71.42,45.51 v71.67,45.76 | C16.2 71.42,45.51 | 71.42,45.51 v71.67,45.25
  Top 0.305: v3.44,78.36 3.31,77.6 3.25,77.54 | 3.25,77.54 C4.1 | v2.8,78.36 3.25,77.79 3.25,77.54 | v10.74,81.86 10.61,81.09 C2.1 9.98,81.29 v10.1,81.86
  Top 0.508: v70.02,49.06 v69.51,49.06 v69,49.06 v68.5,49.06 v67.99,49.06 v67.48,49.06
  Top 0.61: U1.P$2 v78.66,76.43 v78.66,75.8 | v86.3,74.55 86.59,74.84 C3.1 86.59,74.9 v86.94,74.55 | v79.32,81.86 79.32,81.16 C1.1 79.61,81.51 v79.95,81.86 | U2.P$2 v11.35,76.43 v11.35,77.07 | v60.32,70.02 60.74,70.02 C17.2 60.7,69.77 v60.32,69.38 | v65.65,73.7 65.2,73.7 C18.2 65.27,73.45 v65.65,73.07
  Top 0.762: 72.94,57.45 v72.18,58.21 | C15.NEG 72.94,57.45 | v72.94,58.21 72.94,57.45 | v73.7,58.21 73.08,57.59 C15.NEG | v72.18,56.68 72.32,56.68 C15.NEG | v72.94,56.68 73.08,56.82 C15.NEG | v73.7,56.68 73.7,56.82 C15.NEG | C14.NEG 84.23,52.76 v84.37,52.62 | v83.61,52.62 83.61,52.76 C14.NEG | v85.13,52.62 84.99,52.62 C14.NEG | v84.37,54.14 84.37,53.52 C14.NEG | v83.61,54.14 83.61,54 C14.NEG | v85.13,54.14 84.99,54.14 C14.NEG | C22.2 66.85,49.06 v69,49.06 | R_SLEW_1.1 64.16,56.82 C21.2 | v63.92,56.68 v63.92,56.18 64.29,56.18 | v72.31,48.3 v73.07,48.3 72.69,48.68 R_PULLDOWN.1
  other vias: 64.56,66.46 64.56,65.7 63.03,66.46 63.8,65.7 63.03,65.7 73.52,71.42 73.52,70.78 73.52,70.15 72.76,67.61 72.76,66.97 72.76,66.34 72.76,65.7 72.76,65.07 72.76,64.43 72.76,63.8 72.76,63.16 73.52,69.51 73.52,68.75 73.52,67.99
  pour Bottom: 84.37,89.45 89.45,84.37 89.45,5.63 84.37,0.55 5.63,0.55 0.55,5.63 0.55,84.37 5.63,89.45
  pour Top (no thermals): 72.43,62.78 70.65,62.78 70.65,72.43 73.19,72.43 73.19,67.86 72.43,67.86
  pour Top (no thermals): 67.1,50.08 70.4,50.08 70.4,48.56 67.1,48.56
GPS_ENABLE  (via drill 0.35)
  Top 0.254: U$3.P$5 70.65,53.89 v71.16,54.4 | v71.16,51.86 72.69,51.86 | 72.69,51.86 76.75,51.86 v80.56,48.05 | v80.56,46.02 80.56,26.71 v75.48,21.63 | v70.15,16.04 70.2,16.1 BLK1.P2.2_GPIO/PWM | R_PULLDOWN.2 72.69,51.86
  Bottom 0.254: v71.16,54.4 v71.16,51.86 | v80.56,48.05 v80.56,46.02 | v70.15,16.04 70.15,20.87 71.67,22.39 74.72,22.39 v75.48,21.63
GPS_POSITION_VALID  (via drill 0.35)
  Top 0.254: BLK1.P1.7_GPIO/PWM 70.34,19.1 68.82,20.62 v65.83,20.62 | v59.48,20.62 59.48,20.8 55.93,24.35 55.93,44.49 54.91,45.51 54.91,49.57 | 54.91,49.57 54.91,52.87 42.46,65.32 v41.19,65.32 | J1.6 55.66,68.61 v55.66,60.74 | v55.67,49.57 54.91,49.57
  Bottom 0.254: v65.83,20.62 v59.48,20.62 | v55.66,60.74 55.41,60.74 54.65,59.99 54.65,50.33 55.41,49.57 v55.67,49.57 | U3.P$17 40.84,69.92 41.83,68.94 41.83,66.72 41.19,66.08 v41.19,65.32
GPS_RESET_IN  (via drill 0.35)
  Top 0.254: v65.83,19.66 66.03,19.85 68.88,19.85 70.13,18.6 BLK1.P1.6_GPIO/PWM | v59.48,19.6 59.48,19.61 55.47,23.62 55.47,44.3 55.09,44.68 | 55.09,44.68 54.45,45.32 54.45,52.57 42.46,64.56 40.43,64.56 39.41,65.57 32.05,65.57 31.79,65.32 v31.03,65.32 | J1.5 56.43,67.1 v56.43,59.99 | v54.4,43.98 55.09,44.68
  Bottom 0.254: v65.83,19.66 59.53,19.66 v59.48,19.6 | v56.43,59.99 55.11,58.66 55.11,51.13 56.38,49.87 56.38,49.28 54.4,47.3 v54.4,43.98 | U3.P$5 29.86,69.52 29.86,68.12 31.03,66.95 v31.03,65.32
GPS_RXD1  (via drill 0.35)
  Top 0.254: v66.08,16.55 68.11,16.55 69.09,15.57 BLK1.P2.6_GPIO/PWM | v56.18,15.79 53.64,18.33 53.64,39.16 | 53.64,39.16 53.64,39.64 51.96,41.32 51.96,53.65 42.07,63.54 36.62,63.54 v35.35,64.81 | J1.4 59.79,66.03 59.79,65.79 61,64.57 61,58.72 v62.02,58.72 | v52.87,39.16 53.64,39.16
  Bottom 0.254: v66.08,16.55 65.83,16.81 57.19,16.81 v56.18,15.79 | v62.02,58.72 62.02,47.03 54.14,39.16 v52.87,39.16 | U3.P$12 34.84,65.32 v35.35,64.81
GPS_TXD1  (via drill 0.35)
  Top 0.254: BLK1.P2.5_GPIO 68.59,15.06 68.11,15.54 v66.08,15.54 | 53.57,41.63 52.42,42.78 52.42,53.84 42.26,64 37.94,64 v37.13,64.81 | 53.57,41.63 54.1,41.1 54.1,18.89 57.19,15.79 v57.45,15.79 | J1.3 60.49,62.53 60.49,56.68 60.24,56.43 v60.06,56.43 | v53.11,41.17 53.57,41.63
  Bottom 0.254: v57.45,15.79 58.53,15.79 58.98,16.23 65.38,16.23 v66.08,15.54 | v60.06,56.43 60.36,56.12 60.79,56.12 61.51,55.4 61.51,47.17 55.51,41.17 v53.11,41.17 | U3.P$11 34.84,69.92 35.83,68.94 35.83,65.35 35.86,65.32 36.62,65.32 v37.13,64.81
GPS_VIN  (via drill 0.35)
  Top 0.762: 62.53,51.1 v60.49,53.13 v60.49,55.41 61.26,55.41 | 44.24,64.81 v55.92,53.13 v55.92,55.41 44.24,67.1 | 44.24,66.08 44.24,65.32 | 44.24,66.08 44.24,67.1 | 44.24,65.32 44.24,64.81 | 61.76,54.91 61.26,55.41 | 61.89,54.78 62.53,54.14 62.53,53.89 | 62.53,53.89 62.53,53.38 | 62.53,53.38 62.53,52.87 | 62.53,52.87 62.53,52.37 | 62.53,52.37 62.53,51.86 | 62.53,51.86 62.53,51.1 | 61.89,51.73 61.89,54.78 | 61.13,52.49 61.13,55.29 61.26,55.41 | v55.92,53.89 55.67,53.89 44.24,65.32 | v55.92,54.65 55.67,54.65 44.24,66.08 | U$3.P$2 63.03,53.89 | 63.03,53.89 62.53,53.89 | 62.53,53.38 63.8,53.38 | 62.53,52.87 64.3,52.87 | 62.53,51.1 64.3,51.1 | 62.53,52.37 64.3,52.37 64.56,52.11 | 62.53,51.86 63.91,51.86 C_SLEW_1.1 64.42,49.71 C22.1 | 44.24,64.81 42.71,66.34 25.95,66.34 24.84,67.44 U3.P$2 24.84,68.2 25.95,67.1 | 44.24,65.32 42.71,66.84 26.2,66.84 25.95,67.1 | 44.24,66.08 43.22,67.1 | 43.22,67.1 25.95,67.1 | 44.24,67.1 43.22,67.1 | 61.26,55.41 62.78,55.41 62.78,54.14 63.03,53.89 | C21.1 61.76,54.91 | 61.76,54.91 61.89,54.78
  Bottom 0.762: v60.49,53.89 v60.49,55.41 v55.92,55.41 v55.92,54.65 | v60.49,53.89 v60.49,53.13 v55.92,53.13 v55.92,54.65 | v60.49,54.65 v55.92,54.65 | v55.92,53.89 v60.49,53.89
  pour Top (isolate 0.305, no thermals): 65.32,54.14 65.32,50.84 63.8,50.84 63.8,54.14
I2C_SCL  (via drill 0.35)
  Top 0.254: 73.96,20.1 BLK1.P5.1_I2C-SCL-1 71.17,20.1 71.16,20.11 | 73.96,20.1 75.21,20.1 86.37,31.25 86.37,38.94 J3.3 | v73.96,21.12 73.96,20.1 | J4.3 77.51,4.61 77.51,2.82 76.72,2.02 60.04,2.02 59.22,2.84 J2.3 59.16,3.41 R2.2
  Bottom 0.254: v73.96,21.12 73.96,9.44 74.46,8.93 74.46,1.82 74.72,1.57 80.05,1.57 80.05,4.61 J4.3
I2C_SDA  (via drill 0.35)
  Top 0.254: 75.48,19.6 BLK1.P5.0_I2C-SDA-1 | 75.48,19.6 87.08,31.2 87.08,38.87 86.15,39.8 86.15,40.95 85.4,41.7 84.35,41.7 83.08,40.43 J3.1 | v75.48,18.33 75.48,19.6 | J4.1 78.78,2.33 78.02,1.57 58.06,1.57 57.32,2.31 57.32,3.36 58.34,4.38 J2.2 59.41,5.38 R1.2
  Bottom 0.254: v75.48,18.33 75.48,11.22 77.51,9.19 77.51,4.36 78.53,3.34 J4.1
LDO_3V3  (via drill 0.35)  (2 unrouted)
  Top 0.203: 75.56,38.22 BLK1.3.3V@CAN2
  Top 0.254: BLK1.3.3V@MSP1 75.39,25.19 75.99,25.19 76.62,25.82 | 76.62,25.82 77.26,26.46 77.26,35.86 76.75,36.36 75.73,36.36 | v57.7,18.33 58.31,17.72 BLK1.3.3V@MSP2 58.43,13.5 62.27,13.5 62.27,11.47 63.29,10.46 | v59.48,26.2 59.31,26.2 BLK1.3.3V_ANALOG@MSP2 | v77.26,25.19 76.62,25.82 | 63.29,10.46 PHOTODIODE.P$4 | 65.07,43.22 65.07,47.29 66.84,45.51 | 65.07,43.22 65.32,43.22 | 66.84,45.51 70.41,41.94 70.41,38.13 71.16,37.38 74.72,37.38 75.56,38.22 | BLK1.3.3V@CAN1 63.47,41.37 63.92,41.82 63.92,42.97 64.18,43.22 65.07,43.22 | R1.1 62.21,9.37 62.78,9.95 | 62.78,9.95 63.29,10.46 | R2.1 62.78,6.58 62.78,9.95 | C16.1 66.84,45.51
  Top 0.508: C4.2 3.09,74.46 4.11,73.45 54.4,73.45 | 54.4,73.45 60.24,73.45 60.75,72.94 v60.75,71.16 v61.26,71.16 | 65.07,47.29 61.51,50.84 59.48,50.84 59.22,51.1 59.22,55.99 54.4,60.81 54.4,73.45 | SUNSENSOR.P$4 78.46,64.38 76.75,66.08 76.75,66.91 76.24,67.42 v76.24,72.43 v77.26,72.43
  Top 0.61: U2.P$5 C6.1 C4.2
  Bottom 0.254: v57.7,18.33 57.7,24.43 v59.48,26.2 60.49,25.19 v77.26,25.19
  Bottom 0.508: v61.26,71.16 71.82,71.16 72.93,72.28 76.09,72.28 v76.24,72.43 v77.26,72.43
  other vias: 76.75,72.43
LDO_3V3_BYP
  Top 0.61: U2.P$4 C6.2
LDO_5V
  Top 0.254: 74.72,44.24 74.72,44.07 BLK1.5V
  Top 0.508: C3.2 88.06,77.38 88.43,77 88.43,73.7 88.18,73.45 75.73,73.45 74.72,72.43 74.72,66.89 81.96,59.66 84.7,59.66 87.16,57.19 87.16,48.56 85.64,47.03 75.73,47.03 74.72,46.02 74.72,44.07
  Top 0.61: U1.P$5 C5.1 C3.2
LDO_5V_BYP
  Top 0.61: U1.P$4 C5.2
N$1  (via drill 0.35)
  Top 0.254: U$2.8 v85.2,26.65 75.64,17.1 BLK1.P3.5_GPIO_DEBUG | D1.A v82.59,29.25
  Bottom 0.254: v82.59,29.25 v85.2,26.65
N$2
  Top 0.203: U$3.P$1 64.79,55.52 65.33,55.52 65.98,56.18 R_SLEW_1.2
N$3
  Top 0.254: U$2.7 77.43,16.6 BLK1.P3.4_GPIO_DEBUG
N$4
  Top 0.203: C_SLEW_1.2 66.22,52.12 65.77,52.57 65.77,54.21 66.01,54.45 66.04,54.45 U$3.P$6 67.76,54.89 R_PULLUP1.1
N$5
  Top 0.254: U$2.4 84.3,15.6 BLK1.P2.1_RXD
N$6
  Top 0.254: U$2.3 85.65,16.3 83.1,13.75 BLK1.P2.0_TXD
N$7
  Top 0.254: U$2.2 83.76,13.76 82.49,12.49 70.4,12.49 70.09,12.79 BLK1.SBWTDIO
N$8
  Top 0.254: BLK1.SBWTCK 69.59,12.28 69.89,11.98 82.59,11.98 83.35,11.22 U$2.SBWTCK
N$9
  Top 0.508: D1.C 83.33,33.8 83.75,34.22 R5.2
PHOTODIODE_SCL
  Top 0.254: J4.4 73.19,8.93 69.89,8.93 69.41,9.42 PHOTODIODE.P$2
PHOTODIODE_SDA
  Top 0.254: J4.2 74.47,5.12 74.47,6.29 72.29,8.47 69.7,8.47 68.78,9.4 68.78,11.09 68.97,11.29 69.84,11.29 70.67,10.46 PHOTODIODE.P$1
SUNSENSOR_SCL
  Top 0.254: J3.4 84.88,44.8 88.2,48.12 88.2,61.99 80.69,69.51 79.42,69.51 79.22,69.31 79.22,68.44 80.05,67.61 SUNSENSOR.P$2
SUNSENSOR_SDA
  Top 0.254: SUNSENSOR.P$1 82.34,66.59 82.34,62.84 87.75,57.43 87.75,48.31 85.88,46.45 85.82,46.45 J3.2
SYNC1  (via drill 0.35)
  Top 0.254: v41.19,72.43 42.46,72.43 43.22,71.67 43.85,71.67 46.07,69.45 46.07,66.38 56.84,55.6 56.84,24.73 57.45,24.12 62.46,24.12 65.05,21.53 65.05,13.79 BLK1.P7.2_SYNC1
  Bottom 0.254: CONN1.P$45 v41.19,72.43
SYNC2  (via drill 0.35)
  Top 0.254: v43.73,72.43 46.52,69.64 46.52,66.57 57.3,55.79 57.3,46.42 v57.7,46.02 | BLK1.PJ.3_SYNC2 64.59,21.34 62.27,23.66 57.26,23.66 56.38,24.54 56.38,45.25 55.92,45.71 v55.92,46.02
  Bottom 0.254: CONN1.P$49 v43.73,72.43 | v55.92,46.02 v57.7,46.02
VBAT
  Top 0.254: U1.P$1 | U2.P$3 | 10.16,78.74 C2.2 | U4.V_IN 64.05,68.62 63.54,69.13 63.54,69.38 63.29,69.64
  Top 0.508: 79.61,79.29 C1.2 | U2.P$1
  Top 0.61: U1.P$1 81.2,77.39 81.2,75.48 | 81.2,75.48 81.19,75.48 U1.P$3 | U1.P$1 79.61,77.62 79.61,79.29 | U2.P$3 8.81,77.39 8.81,75.48 | 8.81,75.48 U2.P$1 | 10.16,78.74 U2.P$3 | 81.2,75.48 81.2,74.34 81.07,74.21 79.29,74.21 78.78,74.72 61.51,74.72 61.51,74.34 61.38,74.21 8.81,74.21 8.81,75.48
  Top 1.524: CONN1.P$78 CONN1.P$77 61.51,74.72 62.78,73.45 62.78,72.94
  pour Top (no thermals): 63.67,69 62.02,69 62.02,74.72 63.67,74.72